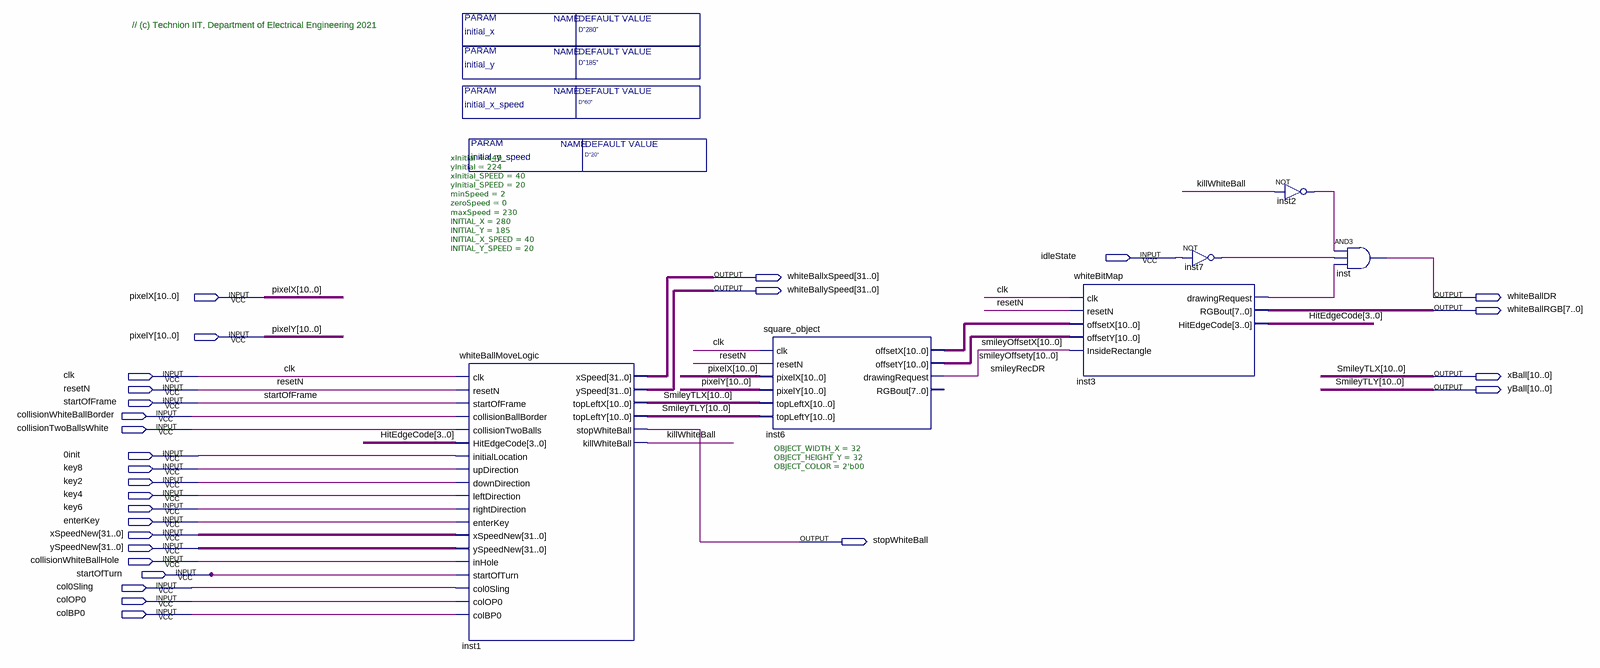
[diagram p0: schematic sheet]
// Quartus schematic whiteBallBlock.bdf as structural Verilog: 6 symbols, 28 pins
module whiteBallBlock #(parameter initial_x = "D\"280\"", parameter initial_y = "D\"185\"", parameter initial_x_speed = "D\"60\"", parameter initial_y_speed = "D\"20\"") (
  input  idleState,
  input  [10:0] pixelX,
  input  [10:0] pixelY,
  input  clk,
  input  resetN,
  input  startOfFrame,
  input  collisionWhiteBallBorder,
  input  collisionTwoBallsWhite,
  input  \0init ,
  input  key8,
  input  key2,
  input  key4,
  input  key6,
  input  enterKey,
  input  [31:0] xSpeedNew,
  input  [31:0] ySpeedNew,
  input  collisionWhiteBallHole,
  input  startOfTurn,
  input  col0Sling,
  input  colOP0,
  input  colBP0,
  output [31:0] whiteBallxSpeed,
  output [31:0] whiteBallySpeed,
  output whiteBallDR,
  output [7:0] whiteBallRGB,
  output [10:0] xBall,
  output [10:0] yBall,
  output stopWhiteBall
);

  wire inst2_out, inst3_drawingrequest, inst7_out, killWhiteBall, smileyRecDR;
  wire [3:0] HitEdgeCode;
  wire [10:0] smileyOffsetX, smileyOffsety;

  whiteBallMoveLogic #(.xInitial(440), .yInitial(224), .xInitial_SPEED(40), .yInitial_SPEED(20), .minSpeed(2), .zeroSpeed(0), .maxSpeed(230), .INITIAL_X(280), .INITIAL_Y(185), .INITIAL_X_SPEED(40), .INITIAL_Y_SPEED(20)) inst1 (
    .clk(clk), .resetN(resetN), .startOfFrame(startOfFrame), .collisionBallBorder(collisionWhiteBallBorder),
    .collisionTwoBalls(collisionTwoBallsWhite), .HitEdgeCode(HitEdgeCode), .initialLocation(\0init ),
    .upDirection(key8), .downDirection(key2), .leftDirection(key4), .rightDirection(key6),
    .enterKey(enterKey), .xSpeedNew(xSpeedNew), .ySpeedNew(ySpeedNew), .inHole(collisionWhiteBallHole),
    .startOfTurn(startOfTurn), .col0Sling(col0Sling), .colOP0(colOP0), .colBP0(colBP0),
    .xSpeed(whiteBallxSpeed), .ySpeed(whiteBallySpeed), .topLeftX(xBall), .topLeftY(yBall),
    .stopWhiteBall(stopWhiteBall), .killWhiteBall(killWhiteBall));
  square_object #(.OBJECT_WIDTH_X(32), .OBJECT_HEIGHT_Y(32), .OBJECT_COLOR(2'b00)) inst6 (
    .clk(clk), .resetN(resetN), .pixelX(pixelX), .pixelY(pixelY), .topLeftX(xBall), .topLeftY(yBall),
    .offsetX(smileyOffsetX), .offsetY(smileyOffsety), .drawingRequest(smileyRecDR));  // open: RGBout
  whiteBitMap inst3 (
    .clk(clk), .resetN(resetN), .offsetX(smileyOffsetX), .offsetY(smileyOffsety),
    .InsideRectangle(smileyRecDR), .drawingRequest(inst3_drawingrequest), .RGBout(whiteBallRGB),
    .HitEdgeCode(HitEdgeCode));
  not inst7 (inst7_out, idleState);
  not inst2 (inst2_out, killWhiteBall);
  and inst (whiteBallDR, inst2_out, inst7_out, inst3_drawingrequest);

  // Other names for the same wires on the sheet: SmileyTLX[10:0] = xBall; SmileyTLY[10:0] = yBall

  // Notes on the sheet:
  //   // (c) Technion IIT, Department of Electrical Engineering 2021
endmodule
